# EAGLE schematic dual.vca.pnl (EAGLE 9.6.2)
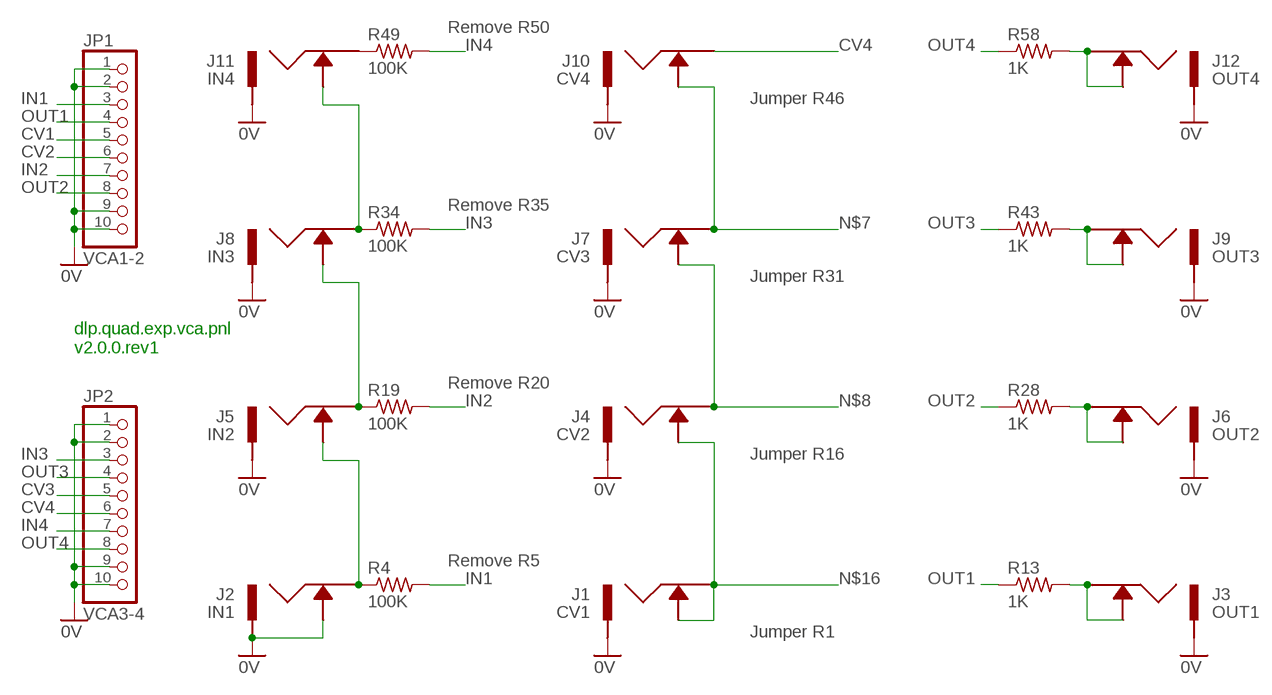
[diagram p0: schematic, sheet 1]

## Parts
J1  CV1  ACJM-MV35-2S  [ACJM-MV35-2S]
J2  IN1  ACJM-MV35-2S  [ACJM-MV35-2S]
J3  OUT1  ACJM-MV35-2S  [ACJM-MV35-2S]
J4  CV2  ACJM-MV35-2S  [ACJM-MV35-2S]
J5  IN2  ACJM-MV35-2S  [ACJM-MV35-2S]
J6  OUT2  ACJM-MV35-2S  [ACJM-MV35-2S]
J7  CV3  ACJM-MV35-2S  [ACJM-MV35-2S]
J8  IN3  ACJM-MV35-2S  [ACJM-MV35-2S]
J9  OUT3  ACJM-MV35-2S  [ACJM-MV35-2S]
J10  CV4  ACJM-MV35-2S  [ACJM-MV35-2S]
J11  IN4  ACJM-MV35-2S  [ACJM-MV35-2S]
J12  OUT4  ACJM-MV35-2S  [ACJM-MV35-2S]
JP1  VCA1-2  PINHD-1X10  [1X10]
JP2  VCA3-4  PINHD-1X10  [1X10]
R4  100K  R-US_0207/7  [0207/7]
R13  1K  R-US_0207/7  [0207/7]
R19  100K  R-US_0207/7  [0207/7]
R28  1K  R-US_0207/7  [0207/7]
R34  100K  R-US_0207/7  [0207/7]
R43  1K  R-US_0207/7  [0207/7]
R49  100K  R-US_0207/7  [0207/7]
R58  1K  R-US_0207/7  [0207/7]

## Nets
0V: J1.P$1 J2.P$1 J2.P$2 J3.P$1 J4.P$1 J5.P$1 J6.P$1 J7.P$1 J8.P$1 J9.P$1 J10.P$1 J11.P$1 J12.P$1 JP1.1 JP1.2 JP1.9 JP1.10 JP2.1 JP2.2 JP2.9 JP2.10
CV1: JP1.5
CV2: JP1.6
CV3: JP2.5
CV4: J10.P$3 JP2.6
IN1: JP1.3 R4.2
IN2: JP1.7 R19.2
IN3: JP2.3 R34.2
IN4: JP2.7 R49.2
N$1: J9.P$2 J9.P$3 R43.2
N$2: J3.P$2 J3.P$3 R13.2
N$3: J2.P$3 J5.P$2 R4.1
N$4: J5.P$3 J8.P$2 R19.1
N$5: J8.P$3 J11.P$2 R34.1
N$7: J7.P$3 J10.P$2
N$8: J4.P$3 J7.P$2
N$16: J1.P$2 J1.P$3 J4.P$2
N$24: J6.P$2 J6.P$3 R28.2
N$31: J12.P$2 J12.P$3 R58.2
N$42: J11.P$3 R49.1
OUT1: JP1.4 R13.1
OUT2: JP1.8 R28.1
OUT3: JP2.4 R43.1
OUT4: JP2.8 R58.1

## Notes on the sheet
- Remove R50
- Jumper R46
- Remove R35
- Jumper R31
- dlp.quad.exp.vca.pnl
  v2.0.0.rev1
- Remove R20
- Jumper R16
- Remove R5
- Jumper R1

## Library data of the parts
J1-J12 = jacks:ACJM-MV35-2S: Amphenol 3.5mm Jack (Vertical) ACJM-MV35-2S http://ca.mouser.com/Search/ProductDetail.aspx?R=ACJM-MV35-2Svirtualkey52380000virtualkey523-ACJMMV352S
JP1 JP2 = pinhead:PINHD-1X10: PIN HEADER
R4 R13 R19 R28 R34 R43 R49 R58 = resistor:R-US_: RESISTOR, American symbol